# Altium schematic sheet SH4 - IMU.SchDoc: Gimbal - IMU
size Letter; Author: Aidan Gratton; DrawnBy: Aidan Gratton; Organization: UW Robotics; Address1: 200 University Avenue; Address2: Waterloo; Address3: Ontario; Address4: Canada N2L 3G6; SheetNumber: 4; SheetTotal: 6
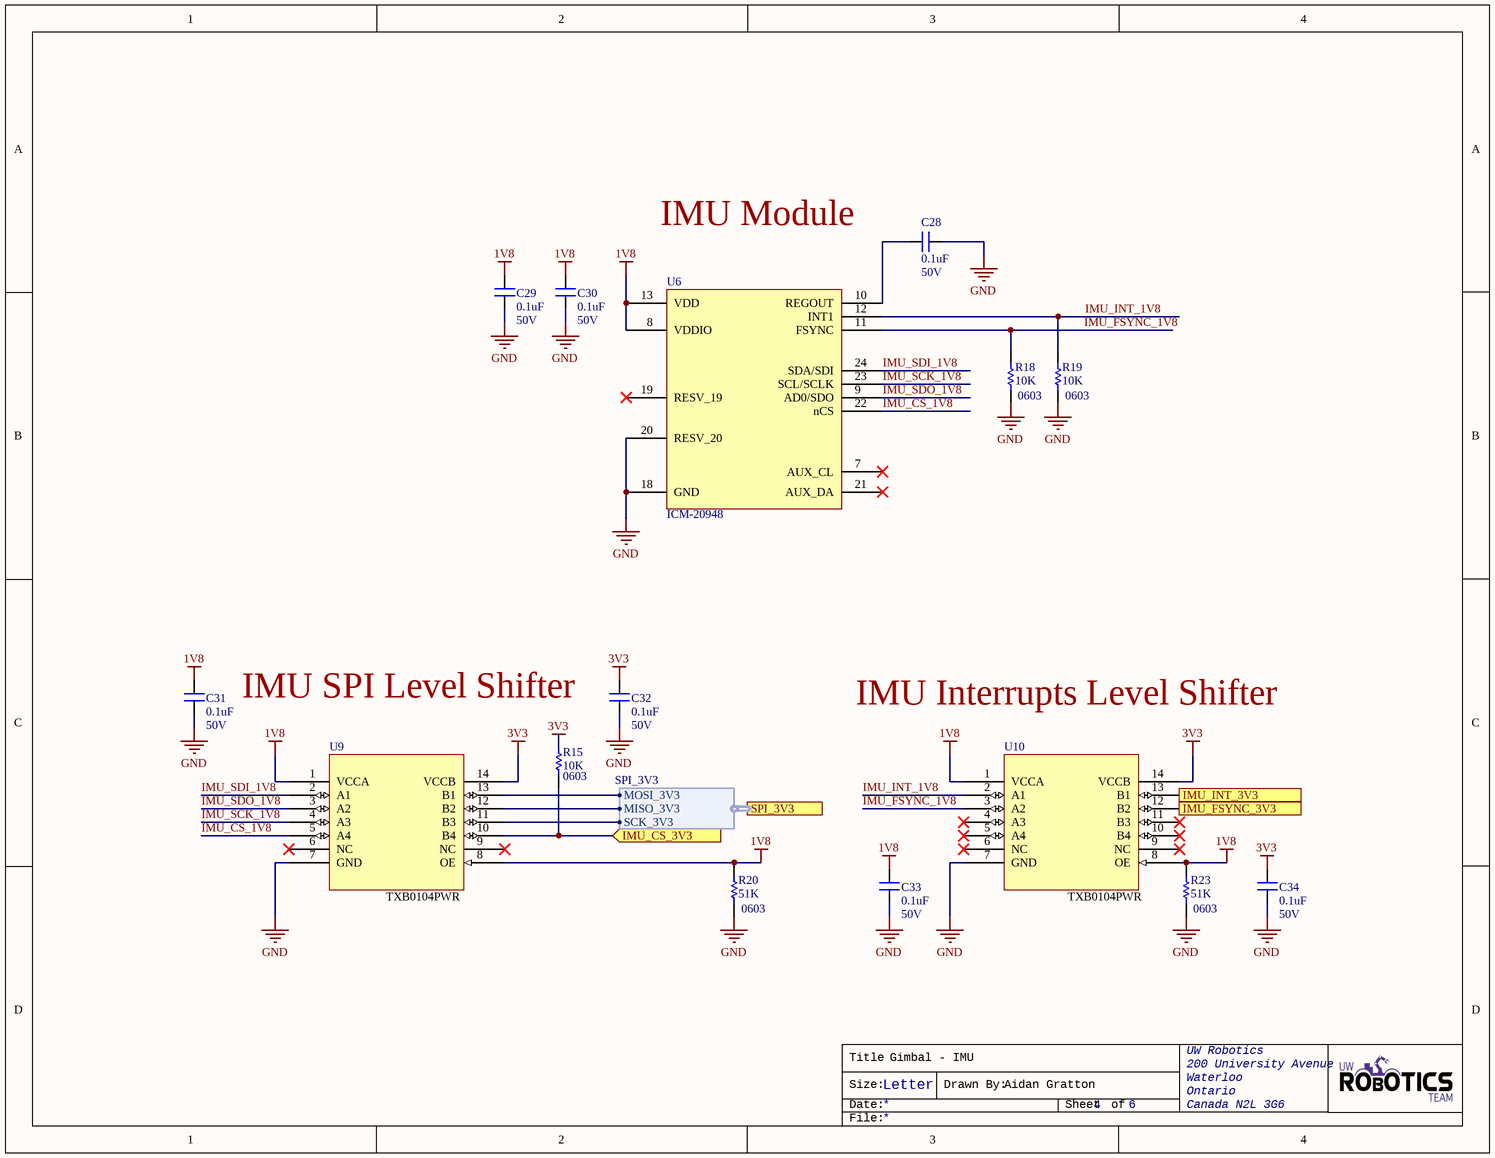
[diagram p0: SH4 - IMU.SchDoc]

## Parts
C28  value 0.1uF  Voltage Rating: 50V  [CAPC2012X140N]  (hidden comment: CAP_0.1uF_50V_0805)
C29  value 0.1uF  Voltage Rating: 50V  [CAPC2012X140N]  (hidden comment: CAP_0.1uF_50V_0805)
C30  value 0.1uF  Voltage Rating: 50V  [CAPC2012X140N]  (hidden comment: CAP_0.1uF_50V_0805)
C31  value 0.1uF  Voltage Rating: 50V  [CAPC2012X140N]  (hidden comment: CAP_0.1uF_50V_0805)
C32  value 0.1uF  Voltage Rating: 50V  [CAPC2012X140N]  (hidden comment: CAP_0.1uF_50V_0805)
C33  value 0.1uF  Voltage Rating: 50V  [CAPC2012X140N]  (hidden comment: CAP_0.1uF_50V_0805)
C34  value 0.1uF  Voltage Rating: 50V  [CAPC2012X140N]  (hidden comment: CAP_0.1uF_50V_0805)
R15  value 10K  Package: 0603  [RESC0603(1608)_N]  (hidden comment: RES_10K_0603)
R18  value 10K  Package: 0603  [RESC0603(1608)_N]  (hidden comment: RES_10K_0603)
R19  value 10K  Package: 0603  [RESC0603(1608)_N]  (hidden comment: RES_10K_0603)
R20  value 51K  Package: 0603  [RESC1608X55N]  (hidden comment: RES_51K_0603)
R23  value 51K  Package: 0603  [RESC1608X55N]  (hidden comment: RES_51K_0603)
U6  IC_9DOF_IMU  [ICM-20948]  (value not drawn)
U9  TXB0104PWR  [PW14]
U10  TXB0104PWR  [PW14]

## Ports
IMU_CS_3V3 (in), IMU_FSYNC_3V3 (in), IMU_INT_3V3 (out), SPI_3V3 (harness SPI_3V3)

## Harnesses
SPI_3V3: MISO_3V3, MOSI_3V3, SCK_3V3

## Nets
1V8: C29.2 C30.2 C31.2 C33.2 R20.2 R23.2 U6.8(VDDIO) U6.13(VDD) U9.1(VCCA) U9.8(OE) U10.1(VCCA) U10.8(OE)
3V3: C32.2 C34.2 R15.2 U9.14(VCCB) U10.14(VCCB)
GND: C28.2 C29.1 C30.1 C31.1 C32.1 C33.1 C34.1 R18.1 R19.1 R20.1 R23.1 U6.18(GND) U6.20(RESV_20) U9.7(GND) U10.7(GND)
IMU_CS_1V8: U6.22(nCS) U9.5(A4)
IMU_CS_3V3: R15.1 U9.10(B4) ; port IMU_CS_3V3
IMU_FSYNC_1V8: R18.2 U6.11(FSYNC) U10.3(A2)
IMU_FSYNC_3V3: U10.12(B2) ; port IMU_FSYNC_3V3
IMU_INT_1V8: R19.2 U6.12(INT1) U10.2(A1)
IMU_INT_3V3: U10.13(B1) ; port IMU_INT_3V3
IMU_SCK_1V8: U6.23(SCL/SCLK) U9.4(A3)
IMU_SDI_1V8: U6.24(SDA/SDI) U9.2(A1)
IMU_SDO_1V8: U6.9(AD0/SDO) U9.3(A2)
NetC28_1: C28.1 U6.10(REGOUT)
NetU9_11: U9.11(B3) ; port SPI_3V3.SCK_3V3
NetU9_12: U9.12(B2) ; port SPI_3V3.MISO_3V3
NetU9_13: U9.13(B1) ; port SPI_3V3.MOSI_3V3

Not connected (* = marked no-connect by the designer): U6 7(AUX_CL)* 19(RESV_19)* 21(AUX_DA)*; U9 6(NC)* 9(NC)*; U10 4(A3)* 5(A4)* 6(NC)* 9(NC)* 10(B4)* 11(B3)*

## Notes on the sheet
- IMU Module
- (near C32) IMU SPI Level Shifter
- IMU Interrupts Level Shifter
- Title
- Size:
- Date:
- Letter
- Drawn By:
- Sheet
- of
- File:

## Library data of the parts
C28-C34 = CAP_0.1uF_50V_0805: CAP CER 0.1UF 50V X7R 0805; Manufacturer 1: Murata Electronics; Manufacturer Part Number 1: GCD21BR71H104KA01L; Capacitance: 100nF; Tolerance: 10%; Mount: Surface Mount; Case/Package: 0805; Case Code (Metric): 2012; Case Code (Imperial): 0805; Min Operating Temperature: -55°C; Max Operating Temperature: 125°C; Dielectric: X7R; Termination: SMD/SMT; Length: 2mm; Height: 1.25mm; Width: 0.049inch; Thickness: 0.049inch; Depth: 1.25mm; Ratings: AEC-Q200; ComponentLink1URL: https://datasheet.ciiva.com/29537/c03e-29537701.pdf?src-supplier=Digi-Key; ComponentLink1Description: https://datasheet.ciiva.com/29537/c03e-29537701.pdf?src-supplier=Digi-Key; Supplier 1: Digi-Key; Supplier Part Number 1: 490-11955-1-ND
R15 = RES_10K_0603: RES SMD 10K OHM 5% 1/10W 0603; Manufacturer: Yageo; MPN: RC0603JR-0710KL; Dimensions: 0.063" L x 0.031" W (1.60mm x 0.80mm); Tolerance: 5%; Supplier Part Number 1: 311-10KGRCT-ND; Supplier 1: Digi-Key
R18 R19 = RES_10K_0603: RES SMD 10K OHM 5% 1/10W 0603; Manufacturer 1: Yageo; Manufacturer Part Number 1: RC0603JR-0710KL; Dimensions: 0.063" L x 0.031" W (1.60mm x 0.80mm); Tolerance: 5%; Supplier Part Number 1: 311-10KGRCT-ND; Supplier 1: Digi-Key; Mount: Surface Mount
R20 R23 = RES_51K_0603: RES SMD 51K OHM 5% 1/10W 0603; Manufacturer 1: Yageo; Manufacturer Part Number 1: RC0603JR-0751KL; Dimensions: 0.063" L x 0.031" W (1.60mm x 0.80mm); Tolerance: 5%; Supplier Part Number 1: 311-51KGRCT-ND; Supplier 1: Digi-Key; Mount: Surface Mount
U6 = IC_9DOF_IMU: IMU ACCEL/GYRO/COMPI2C/SPI 24QFN; Manufacturer: TDK InvenSense; Sensor Type: Accelerometer,Gyroscope,Magnetometer; Output Type: SPI,I2C; Supplier 1: Digi-Key; Category: Inertial Measurement Units (IMUs); Mount: Surface Mount; Case/Package: QFN; Min Operating Temperature: -40°C; Max Operating Temperature: 85°C; Supplier Part Number 1: 1428-1123-1-ND; Manufacturer Part Number: ICM-20948
U9 U10 = IC_4CH_LVL_SHIFTER: 4-Bit Bidirectional Voltage-Level Translator with Auto Direction Sensing / VCCA < VCCB, see datasheet; Manufacturer 1: Texas Instruments; PACKAGE_DESIGNATOR: PW; PIN_COUNT: 14; FAMILY_NAME: AUTO DIRECTION SENSING DUAL SUPPLY TRANSLATOR; INDUSTRY_STD_PKG_TYPE: TSSOP; VCCB MAX: 5.5 V; VCCA MAX: 3.6 V; GENERIC_PART_NUMBER: TXB0104; Datasheet_URL: http://www.ti.com/lit/gpn/TXB0104; Supplier 1: Digi-Key; Supplier Part Number 1: 296-21929-1-ND; Manufacturer Part Number 1: TXB0104PWR